# Altium schematic sheet PinosEspeciais.SchDoc
size A4
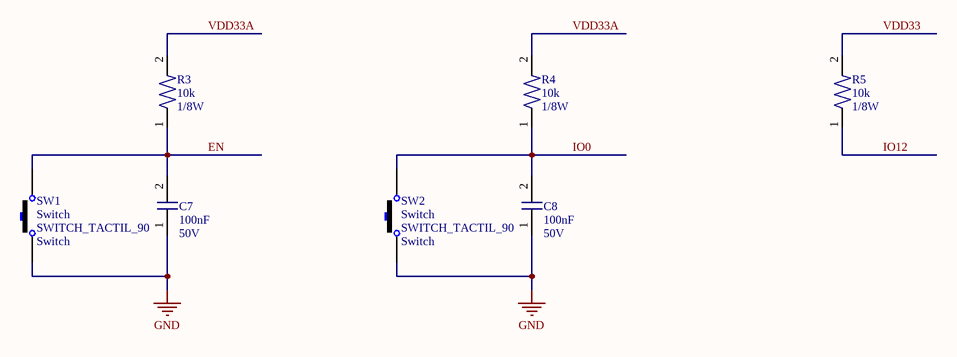
[diagram p0: PinosEspeciais.SchDoc]

## Parts
C7  Capacitance: 100nF  Voltage: 50V  [CAPC1005X05N]  (hidden comment: CAP 100nF/50V)
C8  Capacitance: 100nF  Voltage: 50V  [CAPC1005X05N]  (hidden comment: CAP 100nF/50V)
R3  Resistence: 10k  Power: 1/8W  [RES 10k 1% 1/8W]  (hidden comment: RES 0603)
R4  Resistence: 10k  Power: 1/8W  [RES 10k 1% 1/8W]  (hidden comment: RES 0603)
R5  Resistence: 10k  Power: 1/8W  [RES 10k 1% 1/8W]  (hidden comment: RES 0603)
SW1  Switch  [SWITCH_TACTIL_90]
SW2  Switch  [SWITCH_TACTIL_90]

## Nets
GND: C7.1 C8.1 SW1.1 SW2.1
EN: C7.2 R3.1 SW1.2
IO0: C8.2 R4.1 SW2.2
IO12: R5.1
VDD33: R5.2
VDD33A: R3.2 R4.2

## Library data of the parts
C7 C8 = CAP 100nF/50V: 0.1µF ±10% 50V Ceramic Capacitor X5R 0402 (1005 Metric); Manufacturer 1: Yageo; Manufacturer 1 PN: CC0402KRX5R9BB104; Digikey PN: 311-3342-1-ND; ComponentLink1Description: Datasheet; ComponentLink1URL: https://search.murata.co.jp/Ceramy/image/img/A01X/G101/ENG/GRM022R60J103KE19-01.pdf
R3-R5 = RES 10k 1% 1/8W: 10 kOhms ±1% 0.125W, 1/8W Chip Resistor 0603 (1608 Metric) Anti-Sulfur, Moisture Resistant Thin Film; Manufacturer 1: Stackpole Electronics Inc.; Manufacturer 1 PN: RNCP0603FTD10K0; Digikey PN: RNCP0603FTD10K0CT-ND; ComponentLink1Description: Datasheet; ComponentLink1URL: http://www.yageo.com/documents/recent/PYu-RC_Group_51_RoHS_L_9.pdf; Mouser PN: 755-ESR03EZPF1002
SW1 SW2 = SWITCH_TACTIL_90: Value: Switch